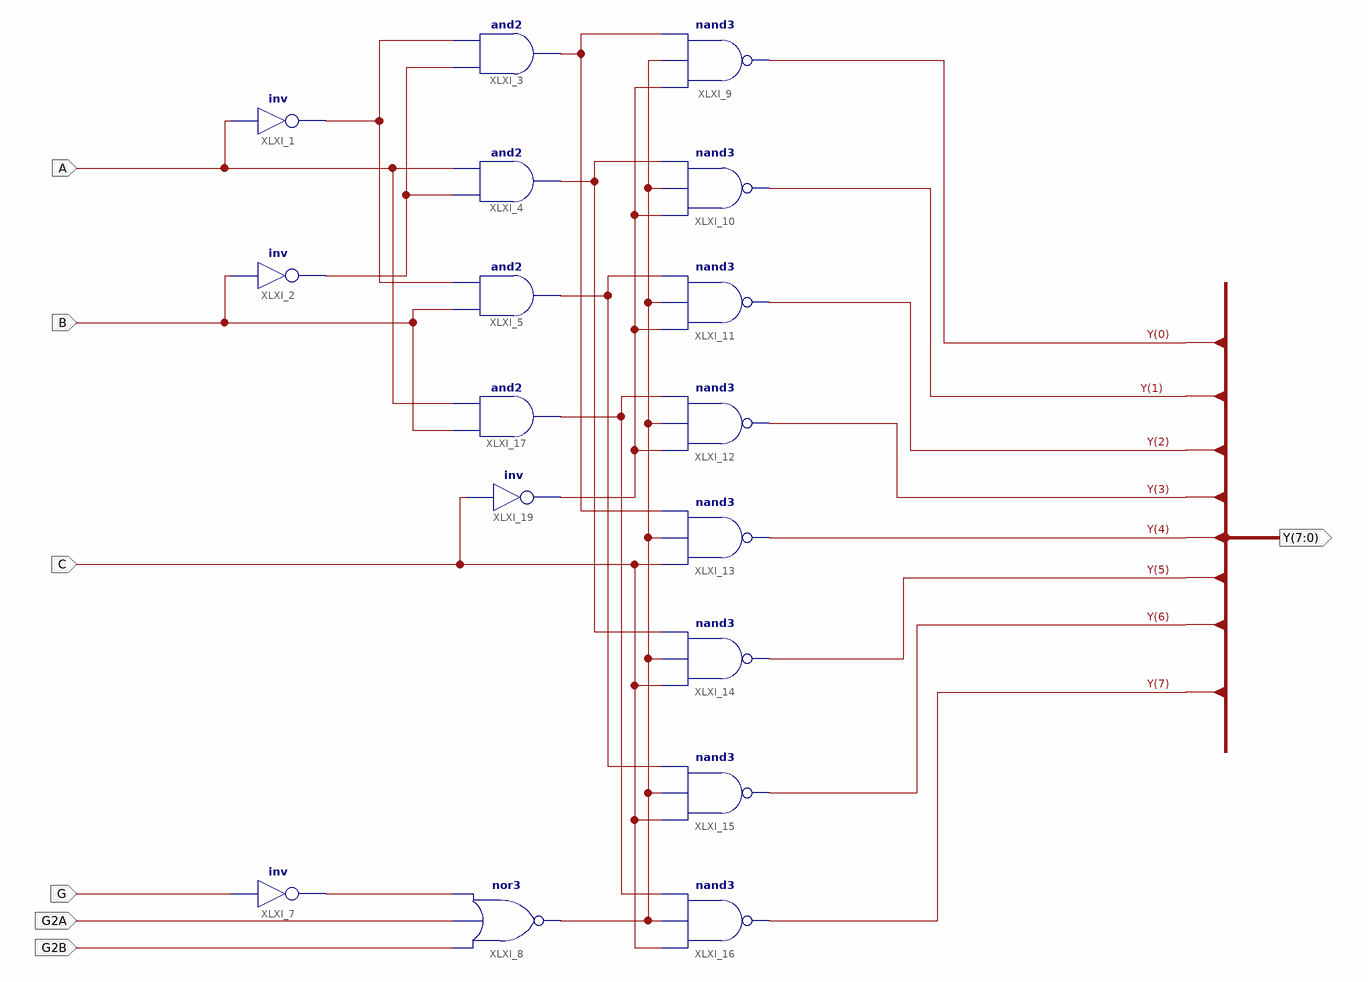
[diagram p0: schematic sheet 1]
// Xilinx ISE schematic D_74LS138.sch (kintex7) as structural Verilog: 17 symbols, 7 ports
module D_74LS138 (
  input  A,
  input  B,
  input  C,
  input  G2A,
  input  G,
  input  G2B,
  output [7:0] Y
);

  wire XLXN_2, XLXN_4, XLXN_5, XLXN_6, XLXN_7, XLXN_8, XLXN_11, XLXN_12, XLXN_48;

  not XLXI_1 (XLXN_11, A);
  not XLXI_2 (XLXN_12, B);
  and XLXI_3 (XLXN_2, XLXN_12, XLXN_11);
  and XLXI_4 (XLXN_4, XLXN_12, A);
  and XLXI_5 (XLXN_5, B, XLXN_11);
  not XLXI_7 (XLXN_48, G);
  nand XLXI_9 (Y[0], XLXN_7, XLXN_8, XLXN_2);
  nand XLXI_10 (Y[1], XLXN_7, XLXN_8, XLXN_4);
  nand XLXI_11 (Y[2], XLXN_7, XLXN_8, XLXN_5);
  nand XLXI_12 (Y[3], XLXN_7, XLXN_8, XLXN_6);
  nand XLXI_13 (Y[4], C, XLXN_8, XLXN_2);
  nand XLXI_14 (Y[5], C, XLXN_8, XLXN_4);
  nand XLXI_15 (Y[6], C, XLXN_8, XLXN_5);
  nand XLXI_16 (Y[7], C, XLXN_8, XLXN_6);
  and XLXI_17 (XLXN_6, B, A);
  nor XLXI_8 (XLXN_8, G2B, G2A, XLXN_48);
  not XLXI_19 (XLXN_7, C);
endmodule
